# EasyEDA schematic 1-Schematic_monitoring_v0.1.json
TITLE: pcb; REV: 1.0; Date: 2026-05-11; Sheet: 1/1; Drawn By: floating.point.integer; Company: Your Company
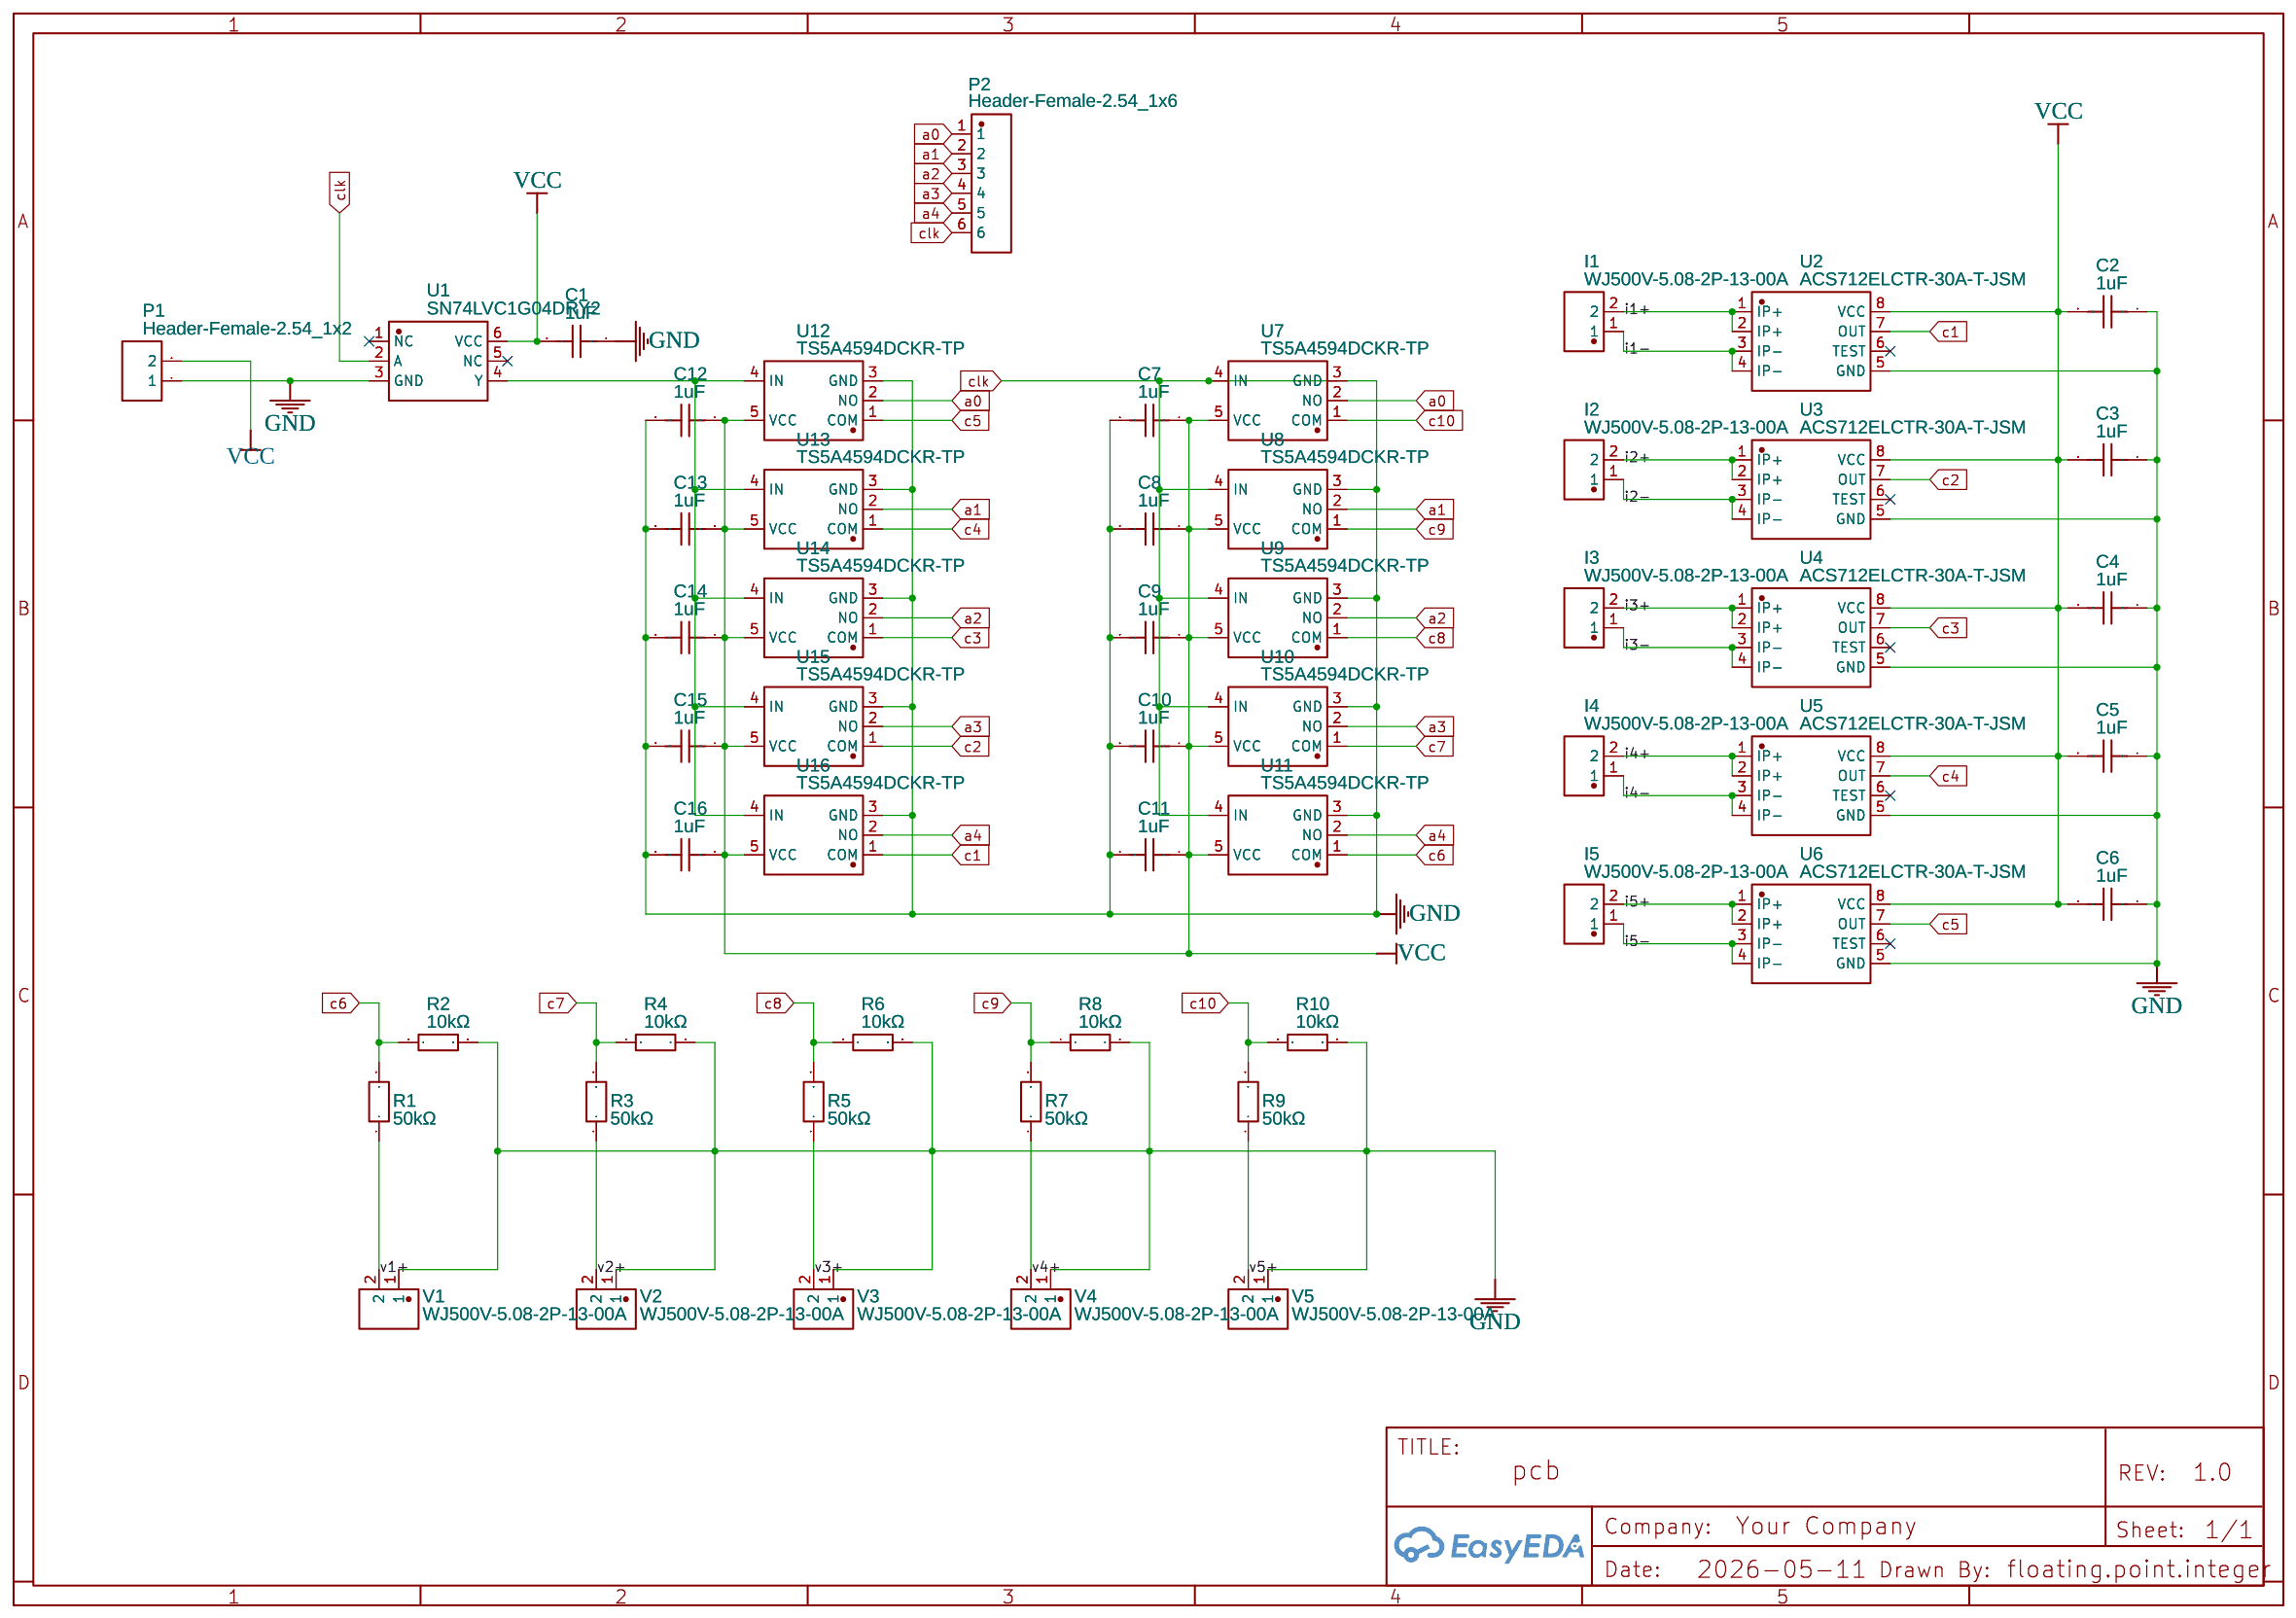
[diagram p0: schematic sheet]

## Parts
C1  1uF  [C0603]
C2  1uF  [C0603]
C3  1uF  [C0603]
C4  1uF  [C0603]
C5  1uF  [C0603]
C6  1uF  [C0603]
C7  1uF  [C0603]
C8  1uF  [C0603]
C9  1uF  [C0603]
C10  1uF  [C0603]
C11  1uF  [C0603]
C12  1uF  [C0603]
C13  1uF  [C0603]
C14  1uF  [C0603]
C15  1uF  [C0603]
C16  1uF  [C0603]
I1  WJ500V-5.08-2P-13-00A  [CONN-TH_2P-P5.08-WJ500V-5.08-2P]
I2  WJ500V-5.08-2P-13-00A  [CONN-TH_2P-P5.08-WJ500V-5.08-2P]
I3  WJ500V-5.08-2P-13-00A  [CONN-TH_2P-P5.08-WJ500V-5.08-2P]
I4  WJ500V-5.08-2P-13-00A  [CONN-TH_2P-P5.08-WJ500V-5.08-2P]
I5  WJ500V-5.08-2P-13-00A  [CONN-TH_2P-P5.08-WJ500V-5.08-2P]
P1  Header-Female-2.54_1x2  [HDR-TH_2P-P2.54-V-F]
P2  Header-Female-2.54_1x6  [HDR-TH_6P-P2.54-V-F]
R1  50kΩ  [R0603]
R2  10kΩ  [R0603]
R3  50kΩ  [R0603]
R4  10kΩ  [R0603]
R5  50kΩ  [R0603]
R6  10kΩ  [R0603]
R7  50kΩ  [R0603]
R8  10kΩ  [R0603]
R9  50kΩ  [R0603]
R10  10kΩ  [R0603]
U1  SN74LVC1G04DRY2  [USON-6_L1.5-W1.0-P0.50-BL]
U2  ACS712ELCTR-30A-T-JSM  [SOP-8_L4.9-W3.9-P1.27-LS6.0-BL]
U3  ACS712ELCTR-30A-T-JSM  [SOP-8_L4.9-W3.9-P1.27-LS6.0-BL]
U4  ACS712ELCTR-30A-T-JSM  [SOP-8_L4.9-W3.9-P1.27-LS6.0-BL]
U5  ACS712ELCTR-30A-T-JSM  [SOP-8_L4.9-W3.9-P1.27-LS6.0-BL]
U6  ACS712ELCTR-30A-T-JSM  [SOP-8_L4.9-W3.9-P1.27-LS6.0-BL]
U7  TS5A4594DCKR-TP  [SOT-353_L2.2-W1.4-P0.65-LS2.4-BR]
U8  TS5A4594DCKR-TP  [SOT-353_L2.2-W1.4-P0.65-LS2.4-BR]
U9  TS5A4594DCKR-TP  [SOT-353_L2.2-W1.4-P0.65-LS2.4-BR]
U10  TS5A4594DCKR-TP  [SOT-353_L2.2-W1.4-P0.65-LS2.4-BR]
U11  TS5A4594DCKR-TP  [SOT-353_L2.2-W1.4-P0.65-LS2.4-BR]
U12  TS5A4594DCKR-TP  [SOT-353_L2.2-W1.4-P0.65-LS2.4-BR]
U13  TS5A4594DCKR-TP  [SOT-353_L2.2-W1.4-P0.65-LS2.4-BR]
U14  TS5A4594DCKR-TP  [SOT-353_L2.2-W1.4-P0.65-LS2.4-BR]
U15  TS5A4594DCKR-TP  [SOT-353_L2.2-W1.4-P0.65-LS2.4-BR]
U16  TS5A4594DCKR-TP  [SOT-353_L2.2-W1.4-P0.65-LS2.4-BR]
V1  WJ500V-5.08-2P-13-00A  [CONN-TH_2P-P5.08-WJ500V-5.08-2P]
V2  WJ500V-5.08-2P-13-00A  [CONN-TH_2P-P5.08-WJ500V-5.08-2P]
V3  WJ500V-5.08-2P-13-00A  [CONN-TH_2P-P5.08-WJ500V-5.08-2P]
V4  WJ500V-5.08-2P-13-00A  [CONN-TH_2P-P5.08-WJ500V-5.08-2P]
V5  WJ500V-5.08-2P-13-00A  [CONN-TH_2P-P5.08-WJ500V-5.08-2P]

## Library data of the parts
C1-C16 = 0603B105K250CT: Contributor: LCSC; Supplier: LCSC; Supplier Part: C388002; Manufacturer: Walsin(华新科); JLCPCB Part Class: Extended Part
I1-I5 V1-V5 = WJ500V-5.08-2P-13-00A: Supplier: LCSC; Supplier Part: C42377752; Manufacturer: KANGNEX(康奈克斯电气); Manufacturer Part: WJ500V-5.08-02P-13-00A; JLCPCB Part Class: Extended Part; Contributor: lcsc
P1 = Header-Female-2.54_1x2: Supplier: LCSC; Manufacturer: BOOMELE(博穆精密); Manufacturer Part: 2.54-1*2P母; Supplier Part: C49661; JLCPCB Part Class: Extended Part
P2 = Header-Female-2.54_1x6: Supplier: LCSC; Manufacturer: BOOMELE(博穆精密); Manufacturer Part: 2.54-1*6P母; Supplier Part: C40877; JLCPCB Part Class: Extended Part
R1 R3 R5 R7 R9 = RT0603BRD0750KL: Supplier: LCSC; Supplier Part: C861451; Manufacturer: YAGEO(国巨); JLCPCB Part Class: Extended Part; Contributor: lcsc
R2 R4 R6 R8 R10 = RT0603DRD0710KL: Contributor: LCSC; Supplier: LCSC; Manufacturer: YAGEO(国巨); Supplier Part: C136944; JLCPCB Part Class: Extended Part
U1 = SN74LVC1G04DRY2: Contributor: LCSC; Supplier: LCSC; Supplier Part: C2802575; Manufacturer: TI(德州仪器); JLCPCB Part Class: Extended Part
U2-U6 = ACS712ELCTR-30A-T-JSM: Supplier: LCSC; Supplier Part: C19673781; Manufacturer: JSMSEMI(杰盛微); JLCPCB Part Class: Extended Part; Contributor: lcsc
U7-U16 = TS5A4594DCKR-TP: Supplier: LCSC; Supplier Part: C46472321; Manufacturer: TECH PUBLIC(台舟); Contributor: lcsc

## Nets
GND: C1.1 C2.1 C3.1 C4.1 C5.1 C6.1 C7.2 C8.2 C9.2 C10.2 C11.2 C12.2 C13.2 C14.2 C15.2 C16.2 P1.1 R2.2 R4.2 R6.2 R8.2 R10.2 U1.3(GND) U2.5(GND) U3.5(GND) U4.5(GND) U5.5(GND) U6.5(GND) U7.3(GND) U8.3(GND) U9.3(GND) U10.3(GND) U11.3(GND) U12.3(GND) U13.3(GND) U14.3(GND) U15.3(GND) U16.3(GND) V1.1 V2.1 V3.1 V4.1 V5.1
v1+: R1.1 V1.2
v2+: R3.1 V2.2
v3+: R5.1 V3.2
v4+: R7.1 V4.2
v5+: R9.1 V5.2
VCC: C1.2 C2.2 C3.2 C4.2 C5.2 C6.2 C7.1 C8.1 C9.1 C10.1 C11.1 C12.1 C13.1 C14.1 C15.1 C16.1 P1.2 U1.6(VCC) U2.8(VCC) U3.8(VCC) U4.8(VCC) U5.8(VCC) U6.8(VCC) U7.5(VCC) U8.5(VCC) U9.5(VCC) U10.5(VCC) U11.5(VCC) U12.5(VCC) U13.5(VCC) U14.5(VCC) U15.5(VCC) U16.5(VCC)
a0: P2.1 U7.2(NO) U12.2(NO)
a1: P2.2 U8.2(NO) U13.2(NO)
a2: P2.3 U9.2(NO) U14.2(NO)
a3: P2.4 U10.2(NO) U15.2(NO)
a4: P2.5 U11.2(NO) U16.2(NO)
c1: U2.7(OUT) U16.1(COM)
c2: U3.7(OUT) U15.1(COM)
c3: U4.7(OUT) U14.1(COM)
c4: U5.7(OUT) U13.1(COM)
c5: U6.7(OUT) U12.1(COM)
c6: R1.2 R2.1 U11.1(COM)
c7: R3.2 R4.1 U10.1(COM)
c8: R5.2 R6.1 U9.1(COM)
c9: R7.2 R8.1 U8.1(COM)
c10: R9.2 R10.1 U7.1(COM)
clk: P2.6 U1.2(A) U7.4(IN) U8.4(IN) U9.4(IN) U10.4(IN) U11.4(IN)
i1+: I1.2 U2.1(IP+) U2.2(IP+)
i1-: I1.1 U2.3(IP-) U2.4(IP-)
i2+: I2.2 U3.1(IP+) U3.2(IP+)
i2-: I2.1 U3.3(IP-) U3.4(IP-)
i3+: I3.2 U4.1(IP+) U4.2(IP+)
i3-: I3.1 U4.3(IP-) U4.4(IP-)
i4+: I4.2 U5.1(IP+) U5.2(IP+)
i4-: I4.1 U5.3(IP-) U5.4(IP-)
i5+: I5.2 U6.1(IP+) U6.2(IP+)
i5-: I5.1 U6.3(IP-) U6.4(IP-)
Net-(U1-4): U1.4(Y) U12.4(IN) U13.4(IN) U14.4(IN) U15.4(IN) U16.4(IN)

Not connected (* = marked no-connect by the designer): U1 1(NC)* 5(NC)*; U2 6(TEST)*; U3 6(TEST)*; U4 6(TEST)*; U5 6(TEST)*; U6 6(TEST)*
